# EAGLE design nano-master (EAGLE 9.5.2)
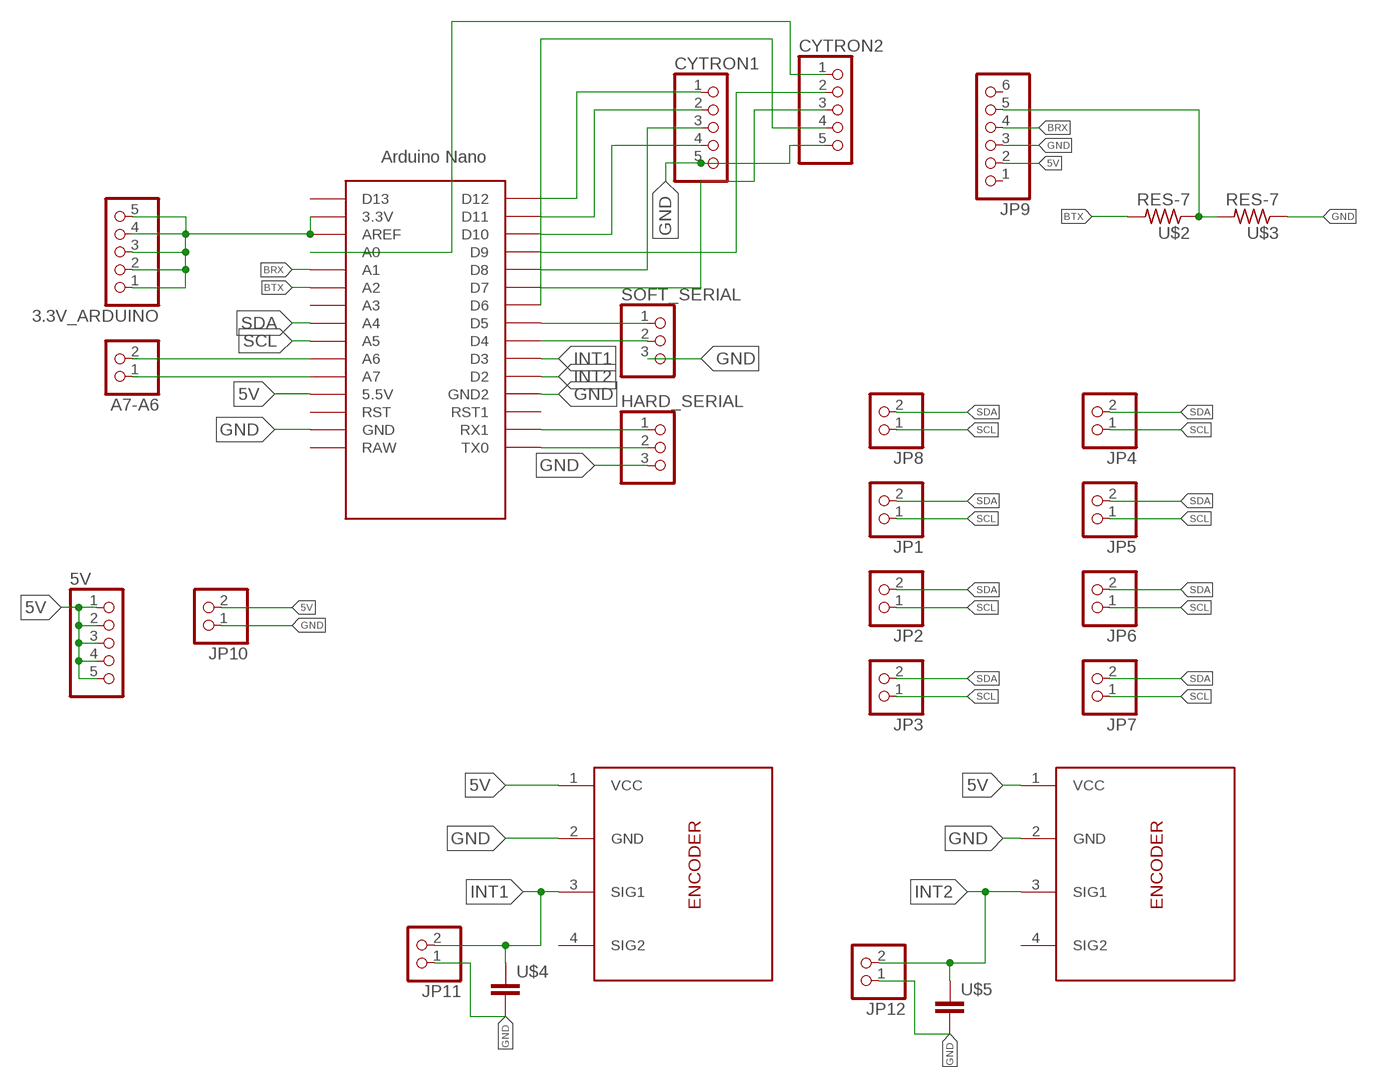
[diagram p0: schematic, sheet 1]

## Parts
3.3V_ARDUINO  PINHD-1X5  [1X05]
5V  PINHD-1X5  [1X05]
A7-A6  PINHD-1X2  [1X02]
CYTRON1  PINHD-1X5  [1X05]
CYTRON2  PINHD-1X5  [1X05]
ENCODER1  ENCODER  [1X04]
ENCODER2  ENCODER  [1X04]
HARD_SERIAL  PINHD-1X3  [1X03]
JP1  PINHD-2_DATA  [1X02]
JP2  PINHD-2_DATA  [1X02]
JP3  PINHD-2_DATA  [1X02]
JP4  PINHD-2_DATA  [1X02]
JP5  PINHD-2_DATA  [1X02]
JP6  PINHD-2_DATA  [1X02]
JP7  PINHD-2_DATA  [1X02]
JP8  PINHD-2_DATA  [1X02]
JP9  PINHD-1X6  [1X06]
JP10  PINHD-2_DATA  [1X02]
JP11  PINHD-2_DATA  [1X02]
JP12  PINHD-2_DATA  [1X02]
SOFT_SERIAL  PINHD-1X3  [1X03]
U$1  NANO  [NANO]
U$2  RES-7  [0204/7]
U$3  RES-7  [0204/7]
U$4  CAPACITOR  [C025-025X050]
U$5  CAPACITOR  [C025-025X050]

## Nets
5V: 5V.1 5V.2 5V.3 5V.4 5V.5 ENCODER1.1(VCC) ENCODER2.1(VCC) JP9.2 JP10.2 U$1.5V(5.5V)
BRX: JP9.4 U$1.A1
BTX: U$1.A2 U$2.2
GND: CYTRON1.5 CYTRON2.5 ENCODER1.2(GND) ENCODER2.2(GND) HARD_SERIAL.3 JP9.3 JP10.1 JP11.1 JP12.1 SOFT_SERIAL.3 U$1.GND U$1.GND1(GND2) U$3.1 U$4.2 U$5.2
INT1: ENCODER2.3(SIG1) JP11.2 U$1.D3 U$4.1
INT2: ENCODER1.3(SIG1) JP12.2 U$1.D2 U$5.1
N$1: SOFT_SERIAL.1 U$1.D5
N$2: SOFT_SERIAL.2 U$1.D4
N$3: HARD_SERIAL.1 U$1.RX1
N$4: HARD_SERIAL.2 U$1.TX0
N$5: CYTRON1.1 U$1.D12
N$6: CYTRON1.2 U$1.D11
N$7: CYTRON1.4 U$1.D10
N$8: CYTRON2.2 U$1.D9
N$9: CYTRON1.3 U$1.D8
N$10: CYTRON2.3 U$1.D7
N$11: CYTRON2.4 U$1.D6
N$12: CYTRON2.1 U$1.A0
N$13: JP9.5 U$2.1 U$3.2
N$22: A7-A6.1 U$1.A7
N$23: A7-A6.2 U$1.A6
N$26: 3.3V_ARDUINO.1 3.3V_ARDUINO.2 3.3V_ARDUINO.3 3.3V_ARDUINO.4 3.3V_ARDUINO.5 U$1.3.3V U$1.AREF
SCL: JP1.1 JP2.1 JP3.1 JP4.1 JP5.1 JP6.1 JP7.1 JP8.1 U$1.A5
SDA: JP1.2 JP2.2 JP3.2 JP4.2 JP5.2 JP6.2 JP7.2 JP8.2 U$1.A4
Unconnected: ENCODER1.4(SIG2) ENCODER2.4(SIG2) JP9.1 JP9.6 U$1.A3 U$1.D13 U$1.RAW U$1.RST U$1.RST1

## Library data of the parts
3.3V_ARDUINO CYTRON1 CYTRON2 = pinhead:PINHD-1X5: PIN HEADER
5V = MIA_LIBRARY:PINHD-1X5: PIN HEADER
A7-A6 = pinhead:PINHD-1X2: PIN HEADER
ENCODER1 ENCODER2 = MIA_LIBRARY:ENCODER
HARD_SERIAL SOFT_SERIAL = pinhead:PINHD-1X3: PIN HEADER
JP1-JP8 JP10-JP12 = MIA_LIBRARY-2-2:PINHD-2_DATA: PIN HEADER
JP9 = MIA_LIBRARY-2-2:PINHD-1X6: PIN HEADER
U$1 = Arduino-clone:NANO: Arduino Nano
U$2 U$3 = MIA_LIBRARY-2-2:RES-7
U$4 U$5 = MIA_LIBRARY-2-2:CAPACITOR

## Board
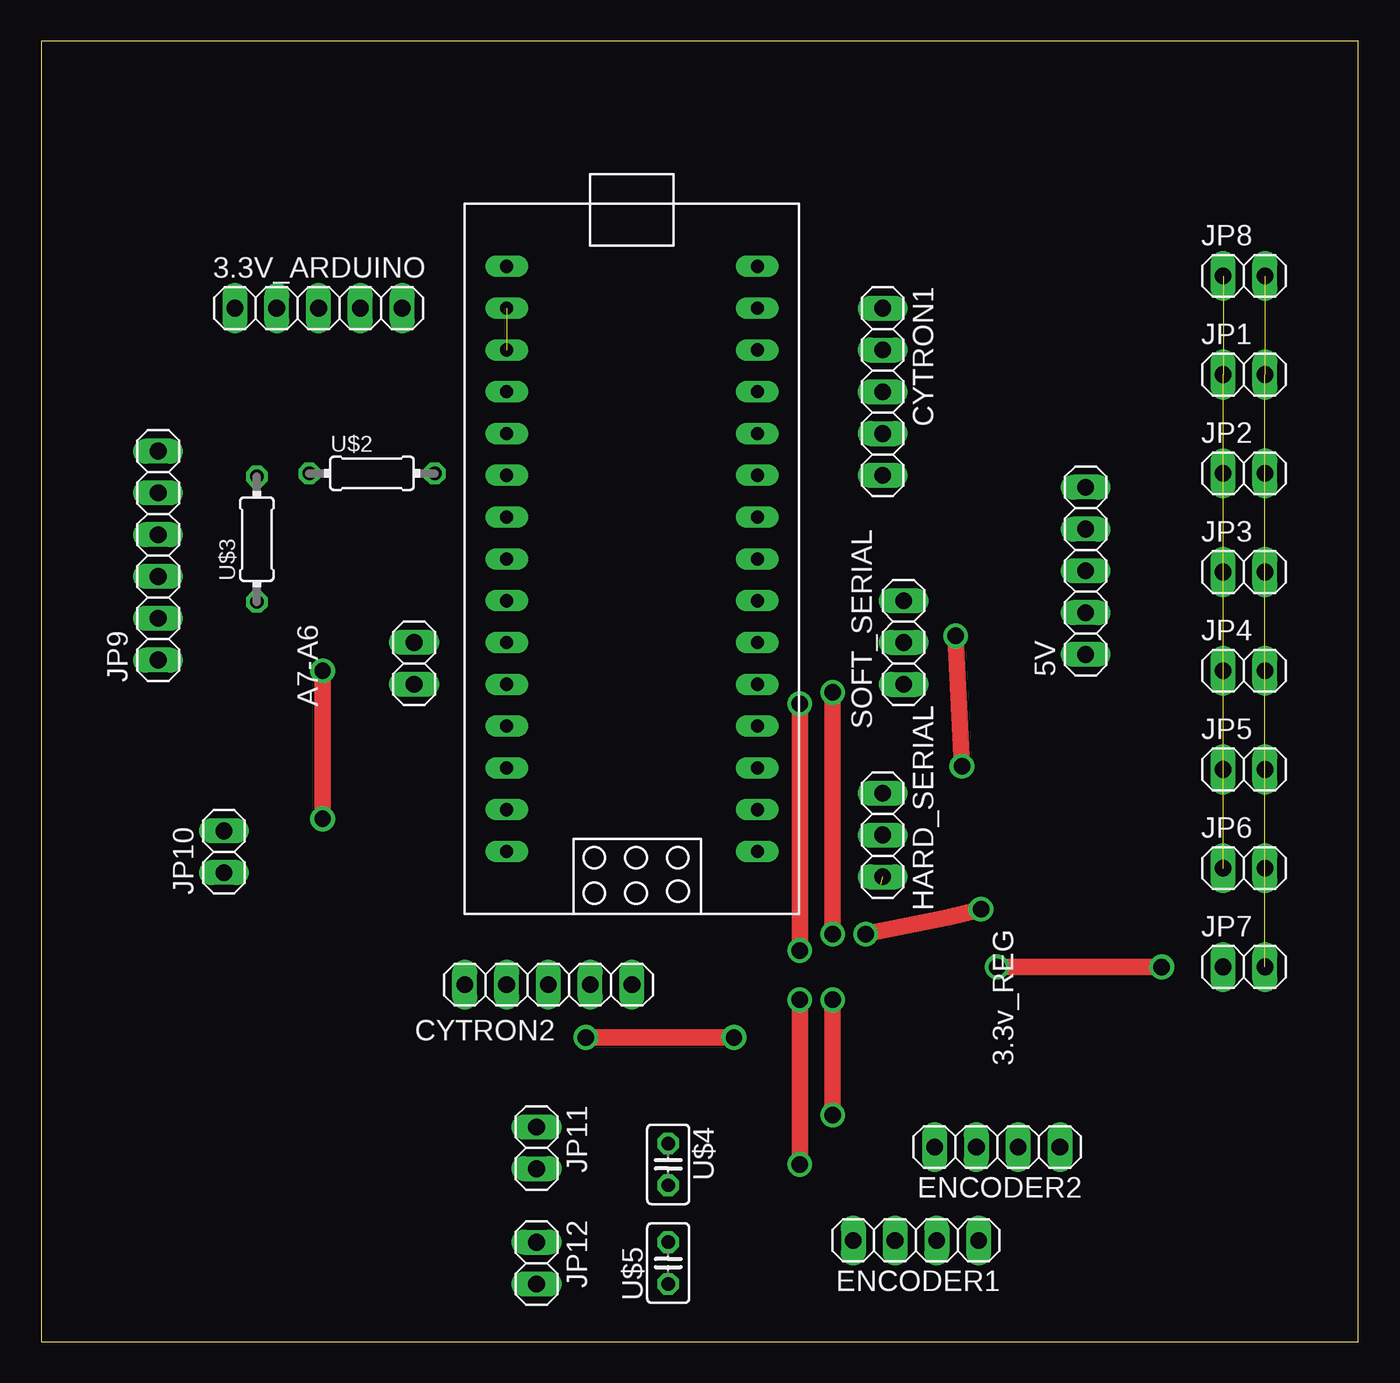
[diagram p1: board, top side]
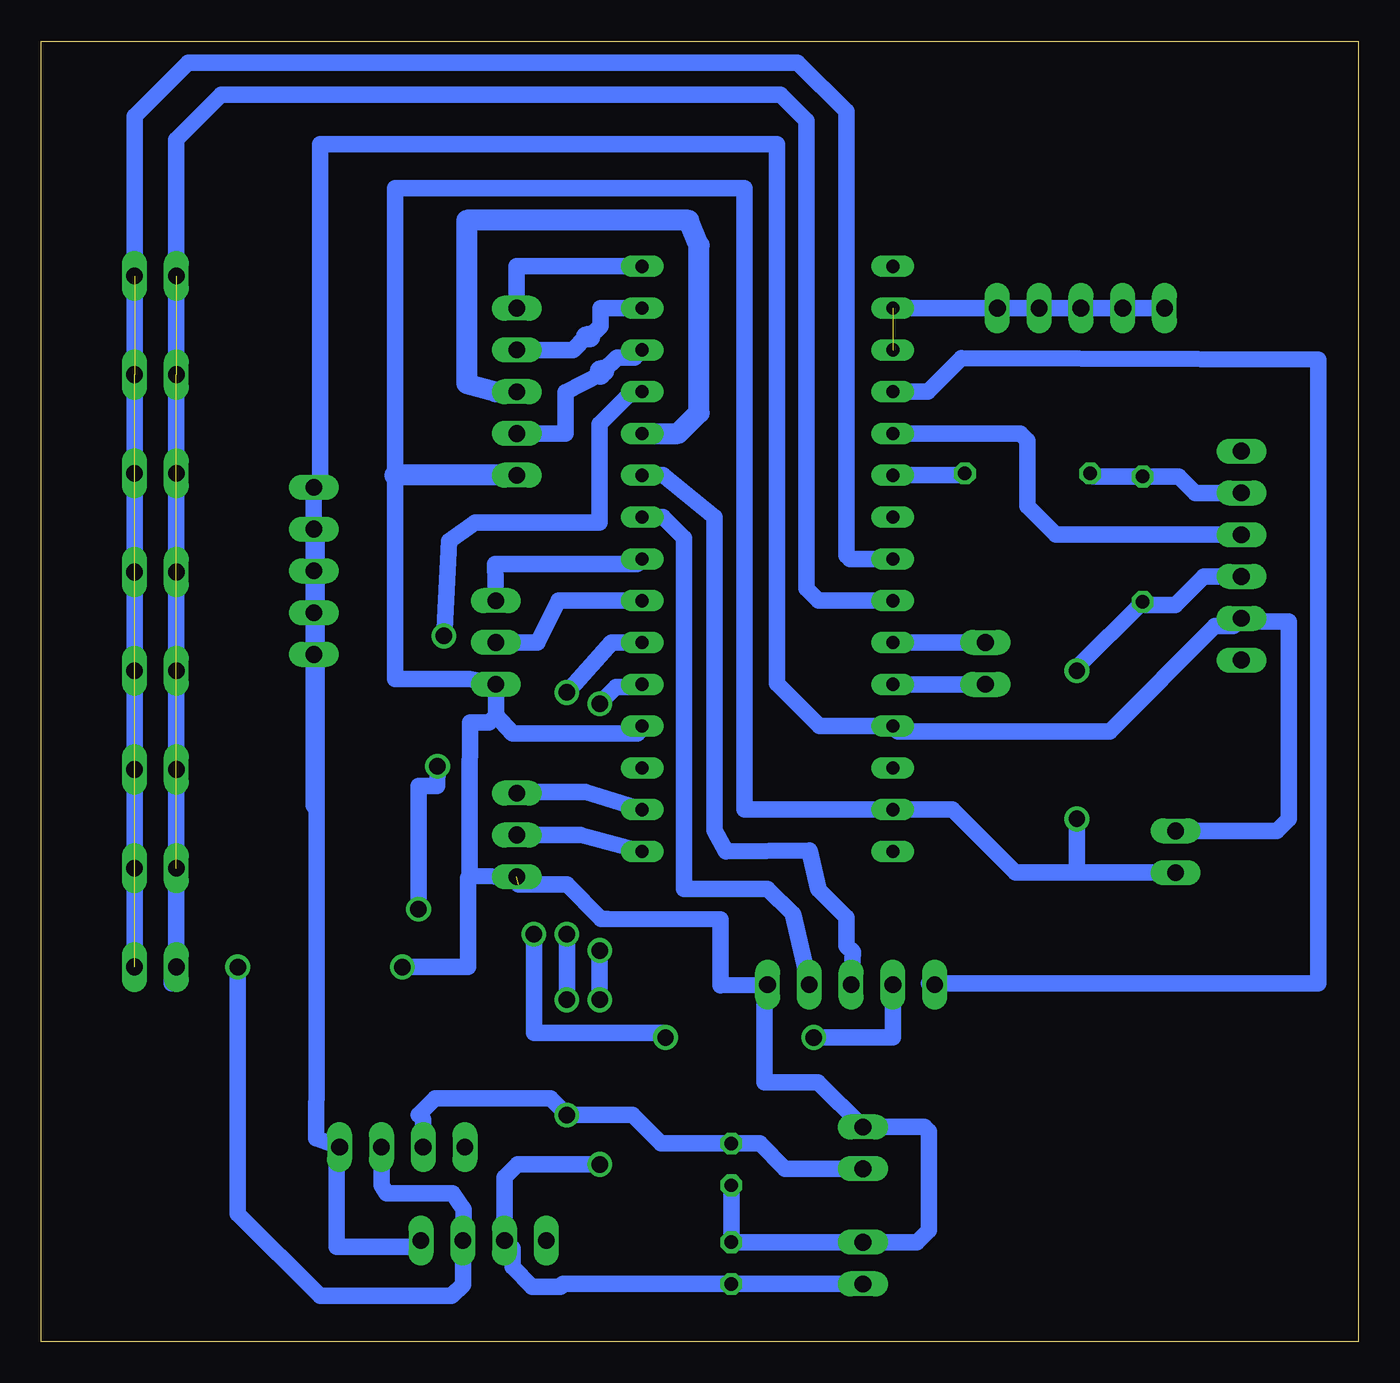
[diagram p2: board, bottom side, seen from below]

Size 80.06 x 79.05 mm. Coordinates in mm from the lower left corner, seen from the top.
Outline: 0.01,0 80.06,0 80.06,79.05 0,79.05 0.01,0
Copper layers (1*16): Top 0.035mm / dielectric 1.5mm / Bottom 0.035mm
Design rules "default *": minimum track width 1mm, minimum drill 1mm, track to track 0.8mm, track to pad 0.8mm, pad to pad 6mil, via to via 6mil, smd to smd 6mil, copper to edge 0.8mm, drill to drill 6mil, minimum pad ring 10mil, minimum via ring 8mil, stop-mask expansion 4mil, vias tented up to drill 0mil, thermal gap 10mil

### Footprints (pad centres in the part's own frame; a part is rotated, then mirrored left to right if it is on the bottom)
1X05 = drill 1.016 long: 1 -5.08,0; 2 -2.54,0; 3 0,0; 4 2.54,0; 5 5.08,0
1X02 = drill 1.016 long: 1 -1.27,0; 2 1.27,0
1X04 = drill 1.016 long: 1 -3.81,0; 2 -1.27,0; 3 1.27,0; 4 3.81,0
1X03 = drill 1.016 long: 1 -2.54,0; 2 0,0; 3 2.54,0
1X06 = drill 1.016 long: 1 -6.35,0; 2 -3.81,0; 3 -1.27,0; 4 1.27,0; 5 3.81,0; 6 6.35,0
NANO = drill 0.8 long: 3.3V -10.16,24.13; 5V -10.16,-1.27; A0 -10.16,19.05; A1 -10.16,16.51; A2 -10.16,13.97; A3 -10.16,11.43; A4 -10.16,8.89; A5 -10.16,6.35; A6 -10.16,3.81; A7 -10.16,1.27; AREF -10.16,21.59; D2 5.08,1.27; D3 5.08,3.81; D4 5.08,6.35; D5 5.08,8.89; D6 5.08,11.43; D7 5.08,13.97; D8 5.08,16.51; D9 5.08,19.05; D10 5.08,21.59; D11 5.08,24.13; D12 5.08,26.67; D13 -10.16,26.67; GND -10.16,-6.35; GND1 5.08,-1.27; RAW -10.16,-8.89; RST -10.16,-3.81; RST1 5.08,-3.81; RX1 5.08,-6.35; TX0 5.08,-8.89
0204/7 = drill 0.813 octagon: 1 -3.81,0; 2 3.81,0
C025-025X050 = drill 0.813 octagon: 1 -1.27,0; 2 1.27,0

### Placement (x,y rotation side)
3.3V_ARDUINO  16.86,62.82 0 top
5V  63.49,46.86 90 top
A7-A6  22.67,41.23 90 top
CYTRON1  51.15,57.74 270 top
CYTRON2  30.83,21.7 0 top
ENCODER1  53.17,6.16 180 top
ENCODER2  58.11,11.84 180 top
HARD_SERIAL  51.15,30.8 270 top
JP1  73.11,58.78 0 top
JP2  73.11,52.78 0 top
JP3  73.11,46.78 0 top
JP4  73.11,40.78 0 top
JP5  73.11,34.78 0 top
JP6  73.11,28.78 0 top
JP7  73.11,22.78 0 top
JP8  73.11,64.78 0 top
JP9  7.11,47.78 90 top
JP10  11.11,29.78 90 top
JP11  30.11,11.78 270 top
JP12  30.11,4.78 270 top
SOFT_SERIAL  52.42,42.5 270 top
U$1  38.45,38.69 0 top
U$2  20.11,52.78 0 top
U$3  13.11,48.78 90 top
U$4  38.11,10.78 270 top
U$5  38.11,4.78 90 top

### Tracks (layer width: path | path; a pad name or v marks a point on that pad's centre or on a via)
5V
  Bottom 1: 63.31,32.78 63.31,16.96 63.34,12.35 ENCODER2.1 62.11,11.59 62.11,5.78 57.35,5.78 ENCODER1.1 | 63.31,32.78 63.31,46.68 | 5V.3 63.49,32.6 63.31,32.78 | 5V.3 5V.5 63.11,52.31 63.11,72.78 35.35,72.78 35.35,40.02 32.75,37.42 U$1.5V 27.97,37.1 15.12,37.1 8.73,43.49 7.59,43.49 JP9.2 6.92,43.78 4.22,43.78 4.22,31.78 4.95,31.05 JP10.2 | 5V.4 63.31,49.22 63.31,46.68 | 5V.3 63.31,46.68 | 5V.1 5V.2 5V.3
BRX
  Bottom 1: JP9.4 18.38,49.05 20.11,50.78 20.11,54.78 20.53,55.2 U$1.A1
BTX
  Bottom 1: U$1.A2 24.04,52.66 U$2.2
GND  (via drill 1)  (1 unrouted)
  Top 1: v58.11,22.78 v68.11,22.78 | v17.11,40.78 v17.11,31.78
  Bottom 1: U$1.GND1 43.8,36.97 51.42,36.97 52.42,38.06 | 52.42,38.06 SOFT_SERIAL.3 54.01,40.28 58.55,40.28 58.55,52.66 58.55,70.12 37.3,70.12 37.3,32.34 | 38.77,21.65 38.77,25.67 45.64,25.69 46.02,25.69 48.11,27.78 51.04,27.78 | 52.42,38.06 52.83,37.65 53.98,37.65 54.01,33.29 54.01,28.3 | 54.01,28.3 HARD_SERIAL.3 | 54.38,5.05 ENCODER1.2 54.42,6.76 | 54.42,6.76 54.38,8.05 55.05,9.01 59.05,9.01 59.38,9.5 ENCODER2.2 | 54.01,28.3 54.11,28.2 54.11,22.78 57.98,22.78 58.11,22.91 v58.11,22.78 | v68.11,22.78 68.11,7.78 63.11,2.78 55.11,2.78 54.42,3.47 54.42,6.76 | JP9.3 9.38,46.51 11.11,44.78 12.92,44.78 U$3.1 17.11,40.97 v17.11,40.78 | CYTRON2.5 36.11,21.5 36.11,15.78 32.84,15.78 JP11.1 26.38,13.05 26.11,12.78 26.11,6.78 26.84,6.05 JP12.1 U$5.2 U$4.2 | JP10.1 17.11,28.51 | 17.11,28.51 20.84,28.51 24.67,32.34 U$1.GND | v17.11,31.78 17.11,28.51
  Bottom 1.016: U$1.GND 37.3,32.34 | CYTRON2.5 38.77,21.65
  Bottom 1.27: CYTRON1.5 58.55,52.66
INT1  (via drill 1)
  Top 1: v48.11,39.47 v48.11,24.78 | v48.11,20.78 v48.11,13.78
  Bottom 1: U$1.D3 45.39,42.5 v48.11,39.47 | v48.11,24.78 v48.11,20.78 | ENCODER2.3 56.84,13.51 57.11,13.78 56.11,14.78 49.11,14.78 v48.11,13.78 44.11,13.78 42.38,12.05 U$4.1 36.38,12.05 34.84,10.51 JP11.2
INT2  (via drill 1)
  Top 1: v46.11,38.78 v46.11,23.78 | v46.11,10.78 v46.11,20.78
  Bottom 1: U$1.D2 43.71,39.78 45.11,39.78 v46.11,38.78 | v46.11,23.78 v46.11,20.78 | v46.11,10.78 51.11,10.78 51.9,9.99 ENCODER1.3 51.42,5.68 51.42,4.54 50.21,3.33 48.5,3.33 48.33,3.51 U$5.1 JP12.2
N$1
  Bottom 1: U$1.D5 43.85,47.26 52.48,47.26 SOFT_SERIAL.1
N$2
  Bottom 1: 43.47,44.98 U$1.D4 48.61,45.04 49.88,42.5 SOFT_SERIAL.2 51.34,42.56
N$3
  Bottom 1: HARD_SERIAL.1 51.07,33.42 46.97,33.42 U$1.RX1
N$4
  Bottom 1: HARD_SERIAL.2 47.26,30.8 U$1.TX0
N$5
  Bottom 1: U$1.D12 51.15,65.36 CYTRON1.1
N$6
  Bottom 1: U$1.D11 46.07,62.82 46.07,61.74 46.73,61.08 | 46.93,61.08 47.73,60.28 CYTRON1.2
  Bottom 1.27: 46.73,61.08 46.93,61.08
N$7
  Bottom 1: U$1.D10 43.98,59.83 45.05,59.83 45.87,59.01 | 46.07,58.81 48.18,57.72 48.18,55.2 CYTRON1.4
  Bottom 1.27: 45.87,59.01 46.07,59.01 46.07,58.81
N$8  (via drill 1)
  Top 1: v57.12,26.29 55.11,25.78 v50.11,24.78 | v42.11,18.5 v33.11,18.5
  Top 1.016: v55.58,42.9 v55.97,34.99
  Bottom 1: 44.15,57.74 46.11,55.78 46.11,49.78 53.69,49.78 | 55.27,48.67 55.54,43.29 | 57.11,27.78 v57.12,26.29 | v50.11,24.78 50.11,18.78 42.11,18.78 v42.11,18.5 | v33.11,18.5 28.3,18.49 28.3,20 CYTRON2.2
  Bottom 1.016: U$1.D9 44.15,57.74 | 53.69,49.78 55.27,48.67 | 55.62,42.75 55.54,43.29 v55.58,42.9 | v55.97,34.99 55.97,34.78 55.98,33.78 57.11,33.78 57.11,27.78
N$9
  Bottom 1.27: U$1.D8 41.34,55.2 40.07,56.47 40.07,66.63 40.7,68.16 54.2,68.16 54.2,58.25 52.42,57.74 CYTRON1.3
N$10
  Bottom 1.016: U$1.D7 42.26,52.66 39.14,50.12 39.14,31.07 38.45,29.8 33.37,29.87 32.83,27.5 31.11,25.78 31.11,24.06 30.73,23.68 CYTRON2.3
N$11
  Bottom 1: 34.37,25.99 CYTRON2.4
  Bottom 1.016: U$1.D6 42.26,50.12 40.99,48.85 40.99,27.52 35.91,27.52 34.37,25.99
N$12
  Bottom 1: 26.15,57.74 U$1.A0 | 2.42,59.7 2.42,21.78 26.11,21.78 25.93,21.97 25.66,21.97
  Bottom 1.016: 26.15,57.74 24.12,59.77 2.42,59.7 | 25.66,21.97 CYTRON2.1
N$13
  Bottom 1: U$2.1 16.11,52.59 U$3.2 10.92,52.59 9.92,51.59 JP9.5
N$22
  Bottom 1: A7-A6.1 U$1.A7
N$23
  Bottom 1: A7-A6.2 U$1.A6
N$26  (1 unrouted)
  Bottom 1: 3.3V_ARDUINO.1 3.3V_ARDUINO.2 3.3V_ARDUINO.3 3.3V_ARDUINO.4 3.3V_ARDUINO.5 U$1.3.3V
SCL  (6 unrouted)
  Bottom 1: U$1.A5 32.81,45.04 33.55,45.78 33.55,74.22 35.11,75.78 69.11,75.78 71.84,73.05 JP8.1 JP7.1 | JP7.1 71.84,22.05 72.11,21.78 72.11,22.51 JP7.1
SDA  (7 unrouted)
  Bottom 1: U$1.A4 30.91,47.58 31.11,47.78 31.11,74.78 34.08,77.75 71.11,77.75 74.38,74.48 JP7.2

### Text on the board
tPlace: 3.3v_REG